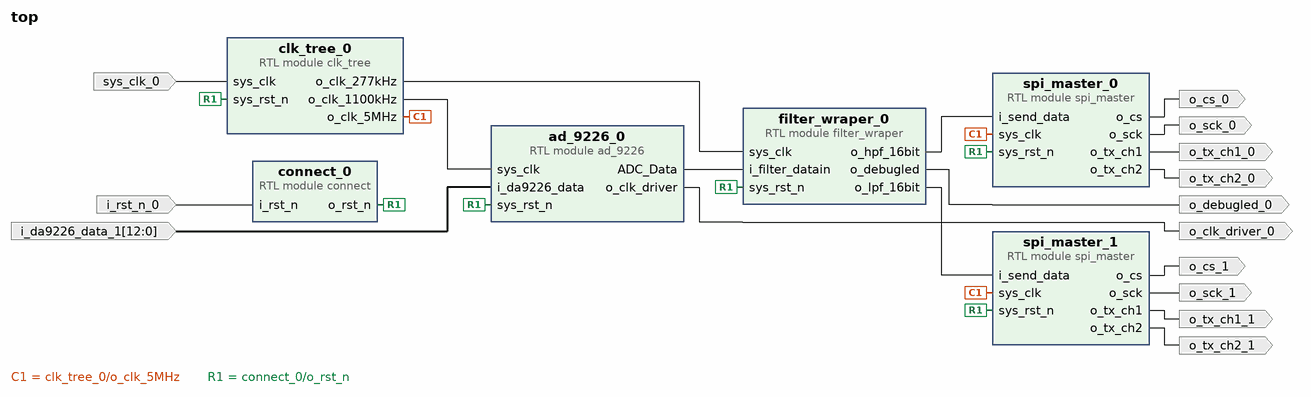
[diagram p0: block diagram of the top level]
# Vivado block design top, xc7a35tcpg236-1, Vivado 2021.2
create_bd_design top

create_bd_port -dir O o_sck_0
create_bd_port -dir O o_cs_0
create_bd_port -dir O o_tx_ch1_0
create_bd_port -dir O o_tx_ch2_0
create_bd_port -dir O o_sck_1
create_bd_port -dir O o_cs_1
create_bd_port -dir O o_tx_ch1_1
create_bd_port -dir O o_tx_ch2_1
create_bd_port -dir I -from 12 -to 0 i_da9226_data_1
create_bd_port -dir I -type clk sys_clk_0
create_bd_port -dir O o_debugled_0
create_bd_port -dir O o_clk_driver_0
create_bd_port -dir I -type rst i_rst_n_0

create_bd_cell -type module -reference spi_master spi_master_1
create_bd_cell -type module -reference spi_master spi_master_0
create_bd_cell -type module -reference ad_9226 ad_9226_0
create_bd_cell -type module -reference clk_tree clk_tree_0
create_bd_cell -type module -reference connect connect_0
create_bd_cell -type module -reference filter_wraper filter_wraper_0

# ---- connections ----

connect_bd_net [get_bd_pins clk_tree_0/o_clk_5MHz] [get_bd_pins spi_master_1/sys_clk] [get_bd_pins spi_master_0/sys_clk]
connect_bd_net [get_bd_pins connect_0/o_rst_n] \
  [get_bd_pins spi_master_1/sys_rst_n] [get_bd_pins spi_master_0/sys_rst_n] [get_bd_pins clk_tree_0/sys_rst_n] \
  [get_bd_pins ad_9226_0/sys_rst_n] [get_bd_pins filter_wraper_0/sys_rst_n]
connect_bd_net [get_bd_pins ad_9226_0/ADC_Data] [get_bd_pins filter_wraper_0/i_filter_datain]
connect_bd_net [get_bd_pins ad_9226_0/o_clk_driver] [get_bd_ports o_clk_driver_0]
connect_bd_net [get_bd_pins clk_tree_0/o_clk_1100kHz] [get_bd_pins ad_9226_0/sys_clk]
connect_bd_net [get_bd_pins clk_tree_0/o_clk_277kHz] [get_bd_pins filter_wraper_0/sys_clk]
connect_bd_net [get_bd_pins filter_wraper_0/o_debugled] [get_bd_ports o_debugled_0]
connect_bd_net [get_bd_pins filter_wraper_0/o_hpf_16bit] [get_bd_pins spi_master_0/i_send_data]
connect_bd_net [get_bd_pins filter_wraper_0/o_lpf_16bit] [get_bd_pins spi_master_1/i_send_data]
connect_bd_net -net i_da9226_data_1_1 [get_bd_ports i_da9226_data_1] [get_bd_pins ad_9226_0/i_da9226_data]
connect_bd_net -net i_rst_n_0_1 [get_bd_ports i_rst_n_0] [get_bd_pins connect_0/i_rst_n]
connect_bd_net [get_bd_pins spi_master_0/o_cs] [get_bd_ports o_cs_0]
connect_bd_net [get_bd_pins spi_master_0/o_sck] [get_bd_ports o_sck_0]
connect_bd_net [get_bd_pins spi_master_0/o_tx_ch1] [get_bd_ports o_tx_ch1_0]
connect_bd_net [get_bd_pins spi_master_0/o_tx_ch2] [get_bd_ports o_tx_ch2_0]
connect_bd_net [get_bd_pins spi_master_1/o_cs] [get_bd_ports o_cs_1]
connect_bd_net [get_bd_pins spi_master_1/o_sck] [get_bd_ports o_sck_1]
connect_bd_net [get_bd_pins spi_master_1/o_tx_ch1] [get_bd_ports o_tx_ch1_1]
connect_bd_net [get_bd_pins spi_master_1/o_tx_ch2] [get_bd_ports o_tx_ch2_1]
connect_bd_net -net sys_clk_0_1 [get_bd_ports sys_clk_0] [get_bd_pins clk_tree_0/sys_clk]

validate_bd_design
save_bd_design
